# Altium schematic sheet Sensing.SchDoc
size A; SheetNumber: 3; SheetTotal: 5
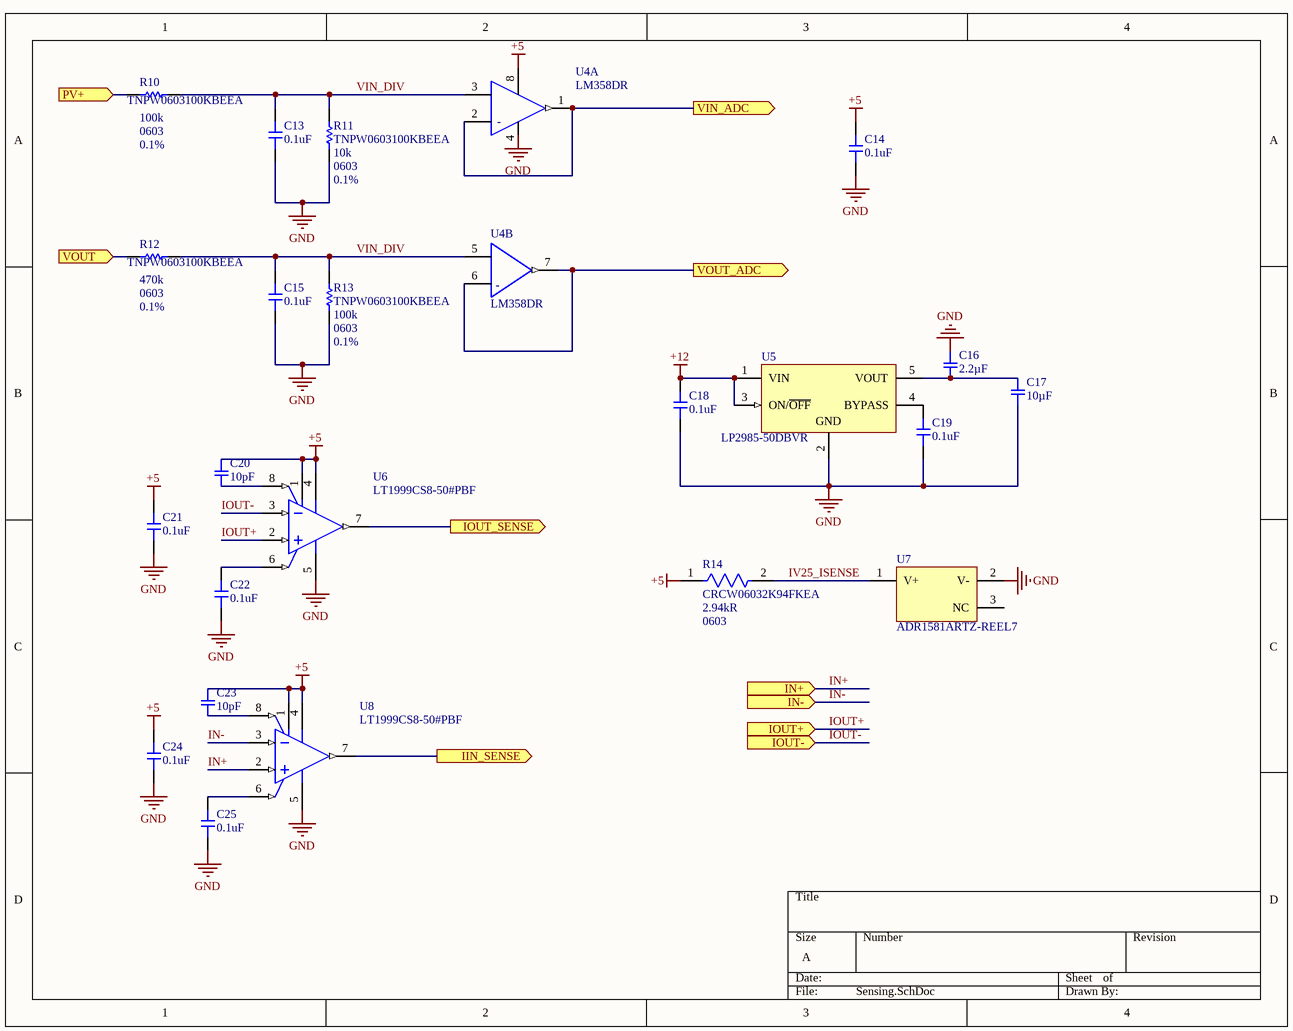
[diagram p0: Sensing.SchDoc]

## Parts
C13  0.1uF
C14  0.1uF
C15  0.1uF
C16  2.2µF  [SMD-0603-RES]
C17  10µF  [SMD-0603-RES]
C18  0.1uF
C19  0.1uF
C20  10pF  [SMD-0603-RES]
C21  0.1uF
C22  0.1uF
C23  10pF  [SMD-0603-RES]
C24  0.1uF
C25  0.1uF
R10  TNPW0603100KBEEA  Reistance: 100k  Size: 0603  Tolerance: 0.1%  [RESC1609X55X30ML10T20]
R11  TNPW0603100KBEEA  Reistance: 10k  Size: 0603  Tolerance: 0.1%  [RESC1609X55X30ML10T20]
R12  TNPW0603100KBEEA  Reistance: 470k  Size: 0603  Tolerance: 0.1%  [RESC1609X55X30ML10T20]
R13  TNPW0603100KBEEA  Reistance: 100k  Size: 0603  Tolerance: 0.1%  [RESC1609X55X30ML10T20]
R14  CRCW06032K94FKEA  Resistance: 2.94kR  Case/Package: 0603  [FP-CRCW0603-e3-IPC_B]
U4  LM358DR  [FP-D0008A-MFG]  (parts A,B of 2)
U5  LP2985-50DBVR  [DBV0005A_M]
U6  LT1999CS8-50#PBF  [LT-S8-8_L]
U7  ADR1581ARTZ-REEL7  [ADI-RT-3_N]
U8  LT1999CS8-50#PBF  [LT-S8-8_L]

## Ports
IIN_SENSE (out), IN+ (in), IN- (in), IOUT+ (in), IOUT- (in), IOUT_SENSE (out), PV+ (in), VIN_ADC (out), VOUT (in), VOUT_ADC (out)

## Nets
+5: C14.2 C20.1 C21.2 C23.1 C24.2 R14.1 U4.8(V+) U6.1(V+) U6.4(V+) U8.1(V+) U8.4(V+)
+12: C18.1 U5.1(VIN) U5.3(ON/~{OFF})
GND: C13.1 C14.1 C15.1 C16.1 C17.2 C18.2 C19.1 C21.1 C22.1 C24.1 C25.1 R11.1 R13.1 U5.2(GND) U6.5(GND) U7.2(V-) U8.5(GND)
IIN_SENSE: U8.7(OUT) ; port IIN_SENSE
IN+: U8.2(+IN) ; port IN+
IN-: U8.3(-IN) ; port IN-
IOUT+: U6.2(+IN) ; port IOUT+
IOUT-: U6.3(-IN) ; port IOUT-
IOUT_SENSE: U6.7(OUT) ; port IOUT_SENSE
IV25_ISENSE: R14.2 U7.1(V+)
PV+: R10.1 ; port PV+
VIN_ADC: U4.1(1OUT) U4.2(IN1-) ; port VIN_ADC
VIN_DIV: C13.2 C15.2 R10.2 R11.2 R12.2 R13.2 U4.3(IN1+) U4.5(IN2+)
VOUT: R12.1 ; port VOUT
VOUT_ADC: U4.6(IN2-) U4.7(2OUT) ; port VOUT_ADC
NetC16_2: C16.2 C17.1 U5.5(VOUT)
NetC19_2: C19.2 U5.4(BYPASS)
NetC20_2: C20.2 U6.8(~{SHDN})
NetC22_2: C22.2 U6.6(REF)
NetC23_2: C23.2 U8.8(~{SHDN})
NetC25_2: C25.2 U8.6(REF)

Not connected (* = marked no-connect by the designer): U4 4(V-); U7 3(NC)

## Notes on the sheet
- Labels drawn without touching a wire or pin: GND
- (in symbol CMP-1685-00009-2, part A) -
- (in symbol CMP-1685-00009-2, part B) -

## Library data of the parts
C13-C15 C18 C19 C21 C22 C24 C25 = C1608X7R1H104K080AA: 0.1uF, 0603, +/- 10%, 50V, X7R; Tolerance: +/- 10%; ID: 1; Mfg: TDK Corporation; TempOperatingMax: 125; TempOperatingMin: -55; TempStorageMax: 40; TempStorageMin: 5; Value: 0.1uF; MfgPN: C1608X7R1H104K080AA; Voltage: 50V; Material: X7R; RoHS: True; SMD: True; Footprint: 0603; Supplier 1: Digi-Key; Supplier Part Number 1: 445-1314-1-ND
C16 = GRM188R61C225KE15D: CAP CER 2.2UF 16V X5R 0603; Manufacturer: Murata Electronics North America; Factory Stock: 0; Unit Price (USD): 0.12; Minimum Quantity: 1; Tolerance: ±10%; Part Number: GRM188R61C225KE15D; Datasheets: http://www.murata.com/~/media/webrenewal/support/library/catalog/products/capacitor/mlcc/c02e.pdf; Image: //media.digikey.com/Renders/Murata%20Renders/ZRB-SERIES-0402.jpg; Digi-Key Part Number: 490-3296-1-ND; Quantity Available: 1668676; @ qty: 0; Packaging: Cut Tape (CT); Series: GRM; Part Status: Active; Value: 2.2µF; Voltage: 16V; Temperature Coefficient: X5R; Operating Temperature: -55°C ~ 85°C; Features: -; Ratings: -; Applications: General Purpose; Mounting Type: Surface Mount, MLCC; Package / Case: 0603 (1608 Metric); Size / Dimension: 0.063" L x 0.031" W (1.60mm x 0.80mm); Height - Seated (Max): -; Thickness (Max): 0.035" (0.90mm); Lead Spacing: -; Lead Style: -
C17 = GRM188R61A106KE69D: CAP CER 10UF 10V X5R 0603; Manufacturer: Murata Electronics North America; Factory Stock: 0; Unit Price (USD): 0.18; Minimum Quantity: 1; Tolerance: ±10%; Part Number: GRM188R61A106KE69D; Datasheets: http://www.murata.com/~/media/webrenewal/support/library/catalog/products/capacitor/mlcc/c02e.pdf; Image: //media.digikey.com/Renders/Murata%20Renders/ZRB-SERIES-0402.jpg; Digi-Key Part Number: 490-10474-1-ND; Quantity Available: 59221; @ qty: 0; Packaging: Cut Tape (CT); Series: GRM; Part Status: Active; Value: 10µF; Voltage: 10V; Temperature Coefficient: X5R; Operating Temperature: -55°C ~ 85°C; Features: Derating Recommended; Ratings: -; Applications: General Purpose; Mounting Type: Surface Mount, MLCC; Package / Case: 0603 (1608 Metric); Size / Dimension: 0.063" L x 0.031" W (1.60mm x 0.80mm); Height - Seated (Max): -; Thickness (Max): 0.037" (0.95mm); Lead Spacing: -; Lead Style: -
C20 C23 = GQM1885C1H100JB01D: CAP CER 10PF 50V NP0 0603; Manufacturer: Murata Electronics North America; Factory Stock: 0; Unit Price (USD): 0.6; Minimum Quantity: 1; Tolerance: ±5%; Temperature Coefficient: C0G, NP0; Part Number: GQM1885C1H100JB01D; Datasheets: http://www.murata.com/~/media/webrenewal/support/library/catalog/products/capacitor/mlcc/c02e.pdf; Image: //media.digikey.com/Renders/Murata%20Renders/0603%28LQG18%29.jpg; Digi-Key Part Number: 490-3570-1-ND; Quantity Available: 26659; @ qty: 0; Packaging: Cut Tape (CT); Series: GQM; Part Status: Active; Value: 10pF; Voltage: 50V; Operating Temperature: -55°C ~ 125°C; Features: High Q, Low Loss; Ratings: -; Applications: RF, Microwave, High Frequency; Mounting Type: Surface Mount, MLCC; Package / Case: 0603 (1608 Metric); Size / Dimension: 0.063" L x 0.031" W (1.60mm x 0.80mm); Height - Seated (Max): -; Thickness (Max): 0.035" (0.90mm); Lead Spacing: -; Lead Style: -
R10-R13 = CMP-2000-03685-1: Manufacturer: Vishay Dale; Part Number: TNPW0603100KBEEA; Manufacturer Part Number: TNPW0603100KBEEA
R14 = CMP-2000-03188-2: RES Thick Film, 2.94kΩ, 1%, 0.1W, 100ppm/°C, 0603; Manufacturer: Vishay; Max Power Dissipation: 100mW; Voltage Rating: 75V; Military Standard: Not; Composition: Thick Film; Number of Terminations: 2; Case Code (Metric): 1608; Max Operating Temperature: 155°C; Contact Plating: Tin; Package Quantity: 10; Power Rating: 100mW; Termination: SMD/SMT; Length: 1.55mm; Min Operating Temperature: -55°C; Radiation Hardening: No; Packaging: Tape and Reel; Tolerance: 1%; Temperature Coefficient: 100ppm/°C; Case Code (Imperial): 0603; Height: 0.45mm; Number of Pins: 2; Depth: 0.85mm; Width: 0.85mm; Weight: 7.1E-05oz; Features: Automotive AEC-Q200; Manufacturer Part Number: CRCW06032K94FKEA
U4 = CMP-1685-00009-2: IC OPAMP GP 2 CIRCUIT 8SOIC; Manufacturer: Texas Instruments; Output Current: 30mA; Min Dual Supply Voltage: 1.5V; Input Offset Voltage (Vos): 7mV; Power Supply Rejection Ratio (PSRR): 65dB; Unity Gain Bandwidth Product: 700kHz; Number of Channels: 2; Min Supply Voltage: 3V; Max Dual Supply Voltage: 16V; Dual Supply Voltage: 9V; Max Supply Voltage: 32V; Nominal Supply Current: 1.2mA; Slew Rate: 0.3V/µs; Input Bias Current: 250nA; Voltage Gain: 100dB; Operating Supply Current: 1mA; REACH SVHC: No SVHC; Package Quantity: 2500; Width: 3.91mm; Max Operating Temperature: 70°C; Min Operating Temperature: 0°C; Mount: Surface Mount; Length: 4.9mm; Radiation Hardening: No; Case/Package: SOIC; Lead Free: Lead Free; Number of Elements: 2; Packaging: Tape and Reel; Output Current per Channel: 30mA; Number of Circuits: 2; Bandwidth: 700kHz; Operating Supply Voltage: 16V; Gain Bandwidth Product: 700kHz; Number of Pins: 8; Number of Amplifiers: 2; Height: 1.58mm; Common Mode Rejection Ratio: 65dB; Contact Plating: Gold; Manufacturer Part Number: LM358DR
U5 = CMP-0758-00084-2: Single Output Low Noise LDO, 150 mA, Fixed 5 V Output, 1.5% Tolerance, 2.2 to 16 V Input, Low IQ, 5-Pin SOT-23 (DBV), -40 to 125 degC, Green (RoHS & no Sb/Br), Tape and Reel; Manufacturer: Texas Instruments; Accuracy (%): 1.5; Iout (Max) (A): 0.15; Fixed Output Options (V): 5; Vdo (Typ) (mV): 280; Output Options: Fixed Output; Iq (Typ) (mA): 0.85; DatasheetVersion: SLVS522N; PackageDescription: 5-Pin Plastic Small Outline, Body 2.9 x 1.6 mm, Pitch 0.95 mm; RoHS: TRUE; ComponentLink3URL: http://www.ti.com/litv/pdf/mpds018j; PartNumber: LP2985-50DBVR; PackageReference: DBV0005A; ComponentLink2URL: http://www.ti.com/lit/ds/symlink/lp2985-50.pdf; Mounting Technology: Surface Mount; ComponentLink1Description: Manufacturer URL; Vin (V): 2.2 to 16; ComponentLink3Description: Package Specification; ComponentLink1URL: http://www.ti.com/; PackageVersion: 4073253-4/L; ComponentLink2Description: Datasheet; Packing: Tape and Reel; Operating Temperature Range (degC): -40 to 125; Manufacturer Part Number: LP2985-50DBVR
U6 U8 = CMP-0359-03365-2: Single Channel, High Voltage, Bidirectional Current Sense Amplifier, 2 MHz Typical GBW, 3 V/us Typical SR, 4.5 to 5.5 V, 8-Pin SOIC (S8-8), Commercial, Pb-Free; Manufacturer: Linear Technology; Linear Technology Part Number: LT1999-50; Manufacturer: Analog Devices / Linear Technology; Vos (mV) Typical: 0.5; SR (V/us) Typical: 3; Is (mA) Typical: 1.55; GBW (MHz) Typical: 2; Vs Min (V): 4.5; Vs Max (V): 5.5; Channels (#): 1; RoHS: Pb-Free; PackageDescription: 8-Pin Plastic Small Outline, Body 4.9 x 3.9 mm, Pitch 1.27 mm; ComponentLink3Description: Package Specification; PackageReference: LT-S8-8; PartNumber: LT1999CS8-50#PBF; DatasheetVersion: Rev. B; ComponentLink1URL: http://www.linear.com/; RevisionNote: URLs updated; Type: CSA; ComponentLink2URL: http://cds.linear.com/docs/en/datasheet/1999fb.pdf; Mounting Technology: Surface Mount; ComponentLink3URL: http://cds.linear.com/docs/en/packaging/05081610_G_SO8.pdf; ComponentLink1Description: Manufacturer URL; PackageVersion: Rev G; ComponentLink2Description: Datasheet; Manufacturer Part Number: LT1999CS8-50#PBF
U7 = CMP-0784-00432-1: Micropower, Precision Shunt Voltage Reference, 1.25 V Output, Industrial, 3-pin SOT23 (RT-3), Reel; Manufacturer: Analog Devices; Ref Out TC (ppm/C): 100; Vout: 1.25V; PackageDescription: 3-Pin Small Outline Transistor Package, Body 2.9 x 1.3 mm, Pitch 0.96 mm; ComponentLink4Description: URL Link1; ComponentLink3URL: http:/www.analog.com/static/imported-files/packages/PKG_PDF/SOT-23-3 (RT)/RT_3.pdf; ComponentLink2URL: http://www.analog.com/static/imported-files/data_sheets/ADR1581.pdf; ComponentLink1Description: Manufacturer URL; Code_JEDEC: TO-236-AB; PartNumber: ADR1581ARTZ-REEL7; ComponentLink2Description: Datasheet; DatasheetVersion: Rev. 0; PackageVersion: 011909-C, 02/2009; ComponentLink4URL: Product URL:http://www.analog.com/en/special-linear-functions/voltage-references/adr1581/products/product.html; Mounting Technology: Surface Mount; PackageReference: RT-3; Packing: Reel; ComponentLink1URL: http://www.analog.com/en/index.html; ComponentLink3Description: Package Specification; Operating Temp Range: -40 to 85 degC; Manufacturer Part Number: ADR1581ARTZ-REEL7